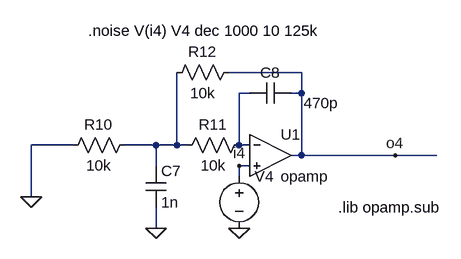
[diagram p0: schematic filtro ruido i4.asc]
filtro ruido i4.asc, the LTspice schematic file:
Version 4
SHEET 1 1900 680
WIRE -1616 -528 -1728 -528
WIRE -1696 -496 -1712 -496
WIRE -1616 -496 -1616 -528
WIRE -1616 -496 -1632 -496
WIRE -1968 -416 -2032 -416
WIRE -1840 -416 -1888 -416
WIRE -1808 -416 -1808 -528
WIRE -1808 -416 -1840 -416
WIRE -1792 -416 -1808 -416
WIRE -1712 -416 -1712 -496
WIRE -1696 -416 -1712 -416
WIRE -1616 -400 -1616 -496
WIRE -1616 -400 -1632 -400
WIRE -1472 -400 -1616 -400
WIRE -1408 -400 -1472 -400
WIRE -1840 -384 -1840 -416
WIRE -1696 -384 -1712 -384
WIRE -1712 -368 -1712 -384
WIRE -2032 -336 -2032 -416
WIRE -1840 -288 -1840 -320
FLAG -1712 -288 0
FLAG -1840 -288 0
FLAG -2032 -336 0
FLAG -1712 -384 i4
FLAG -1472 -400 o4
SYMBOL res -1984 -400 R270
WINDOW 0 32 56 VTop 2
WINDOW 3 0 56 VBottom 2
SYMATTR InstName R10
SYMATTR Value 10k
SYMBOL cap -1856 -384 R0
SYMATTR InstName C7
SYMATTR Value 1n
SYMBOL res -1808 -400 R270
WINDOW 0 32 56 VTop 2
WINDOW 3 0 56 VBottom 2
SYMATTR InstName R11
SYMATTR Value 10k
SYMBOL res -1824 -512 R270
WINDOW 0 32 56 VTop 2
WINDOW 3 0 56 VBottom 2
SYMATTR InstName R12
SYMATTR Value 10k
SYMBOL cap -1696 -480 R270
WINDOW 0 32 32 VTop 2
WINDOW 3 16 110 VBottom 2
SYMATTR InstName C8
SYMATTR Value 470p
SYMBOL voltage -1712 -384 R0
WINDOW 123 24 44 Left 2
WINDOW 39 0 0 Left 2
SYMATTR InstName V4
SYMATTR Value ""
SYMBOL Opamps\\opamp -1664 -464 R0
SYMATTR InstName U1
TEXT -1944 -592 Left 2 !.noise V(i4) V4 dec 1000 10 125k
TEXT -1560 -320 Left 2 !.lib opamp.sub

The netlist it stands for:
* filtro ruido i4.asc
R10 0 N002 10k
C7 N002 0 1n
R11 N002 N001 10k
R12 N002 o4 10k
C8 N001 o4 470p
V4 i4 0
XU1 N001 i4 o4 opamp Aol=100K GBW=10Meg  ; pins invin noninvin out
.noise V(i4) V4 dec 1000 10 125k
.lib opamp.sub
.backanno
.end